# Altium schematic sheet BMS.SchDoc
size A4; SheetNumber: 1; SheetTotal: 1
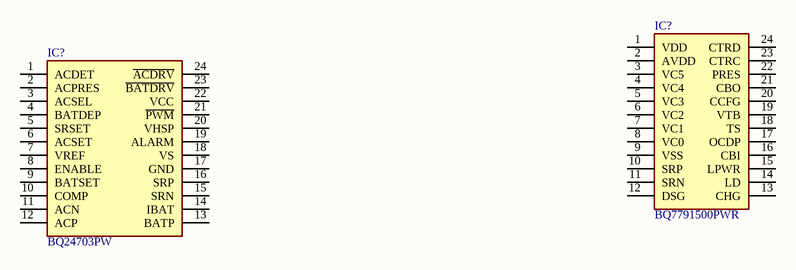
[diagram p0: BMS.SchDoc]

## Parts
(Parts that share a designator on the sheet are numbered #1, #2 ... from top to bottom, then left to right.)
IC?#1  BQ7791500PWR  [SOP65P640X120-24N]
IC?#2  BQ24703PW  [SOP65P640X120-24N]

## Nets

Not connected (* = marked no-connect by the designer): IC?#1 1(VDD) 2(AVDD) 3(VC5) 4(VC4) 5(VC3) 6(VC2) 7(VC1) 8(VC0) 9(VSS) 10(SRP) 11(SRN) 12(DSG) 13(CHG) 14(LD) 15(LPWR) 16(CBI) 17(OCDP) 18(TS) 19(VTB) 20(CCFG) 21(CBO) 22(PRES) 23(CTRC) 24(CTRD); IC?#2 1(ACDET) 2(ACPRES) 3(ACSEL) 4(BATDEP) 5(SRSET) 6(ACSET) 7(VREF) 8(ENABLE) 9(BATSET) 10(COMP) 11(ACN) 12(ACP) 13(BATP) 14(IBAT) 15(SRN) 16(SRP) 17(GND) 18(VS) 19(ALARM) 20(VHSP) 21(~{PWM}) 22(VCC) 23(~{BATDRV}) 24(~{ACDRV})

## Library data of the parts
IC?#1 = BQ7791500PWR: Integrated Circuit; Manufacturer_Name: Texas Instruments; Datasheet Link: http://www.ti.com/lit/gpn/bq77915; Height: 1.2mm; Manufacturer_Part_Number: BQ7791500PWR; Mouser Part Number: 595-BQ7791500PWR; Mouser Price/Stock: https://www.mouser.co.uk/ProductDetail/Texas-Instruments/BQ7791500PWR?qs=F5EMLAvA7IBs7uL7im8AUA%3D%3D; Arrow Part Number: BQ7791500PWR; Arrow Price/Stock: https://www.arrow.com/en/products/bq7791500pwr/texas-instruments?region=nac
IC?#2 = BQ24703PW: Integrated Circuit; Manufacturer_Name: Texas Instruments; Datasheet Link: https://datasheet.datasheetarchive.com/originals/distributors/Datasheets-DGA15/727605.pdf; Height: 1.2mm; Manufacturer_Part_Number: BQ24703PW; Mouser Part Number: 595-BQ24703PW; Mouser Price/Stock: https://www.mouser.co.uk/ProductDetail/Texas-Instruments/BQ24703PW/?qs=YxwvVplHM%2FkNi37zPuJDKQ%3D%3D; Arrow Part Number: BQ24703PW; Arrow Price/Stock: https://www.arrow.com/en/products/bq24703pw/texas-instruments